# EAGLE design Arduino_MEGA_2560-Rev5- Shield (EAGLE 7.5.0)
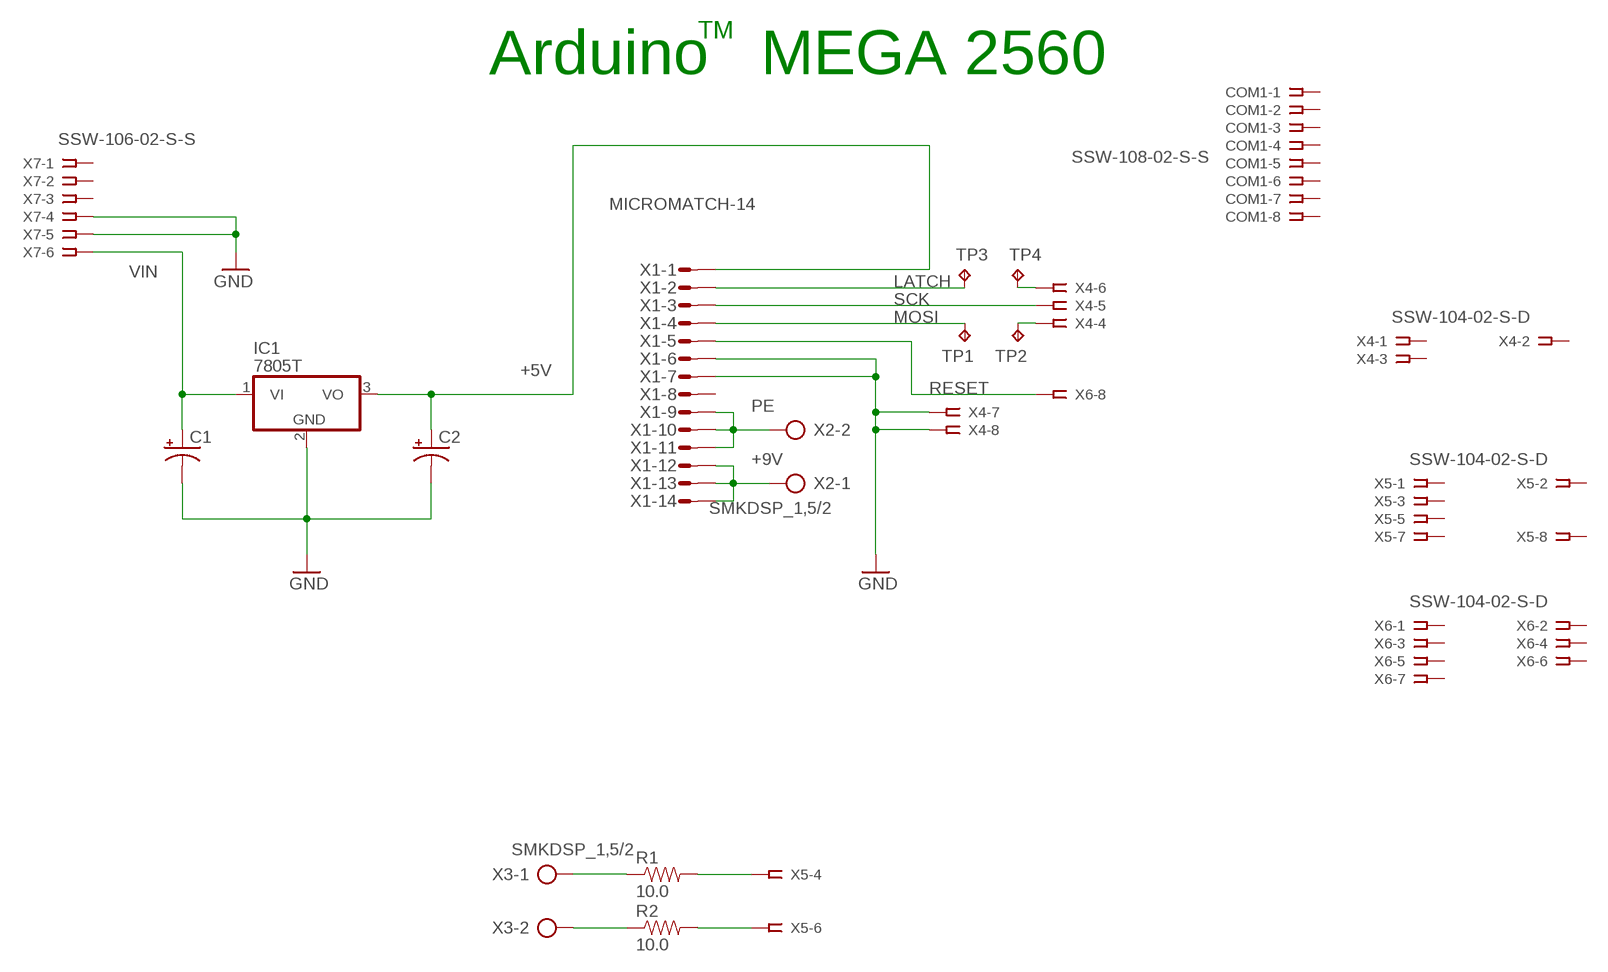
[diagram p0: schematic, sheet 1]

## Parts
C1  CAP_POL7343  [EIA7343]
C2  CAP_POL7343  [EIA7343]
COM1  SSW-108-02-S-S  [SSW-108-02-S-S]
IC1  7805T  [TO220H]
R1  10.0  10OHM-1/4W-1%(PTH)VERT  [AXIAL-0.1]
R2  10.0  10OHM-1/4W-1%(PTH)VERT  [AXIAL-0.1]
TP1  TPPAD1-13  [P1-13]
TP2  TPPAD1-13  [P1-13]
TP3  TPPAD1-13  [P1-13]
TP4  TPPAD1-13  [P1-13]
X1  MICROMATCH-14  [MICROMATCH-14]
X2  SMKDSP_1,5/2  [SMKDSP_1,5/2]
X3  SMKDSP_1,5/2  [SMKDSP_1,5/2]
X4  SSW-104-02-S-D  [SSW-104-02-S-D]
X5  SSW-104-02-S-D  [SSW-104-02-S-D]
X6  SSW-104-02-S-D  [SSW-104-02-S-D]
X7  SSW-106-02-S-S  [SSW-106-02-S-S]

## Nets
+5V [power usb]: C2.A(+) IC1.3(VO) X1.1
+9V: X1.12 X1.13 X1.14 X2.1
GND [gnd]: C1.C(-) C2.C(-) IC1.2(GND) X1.6 X1.7 X4.7 X4.8 X7.4 X7.5
LATCH: TP3.TP X1.2
MOSI: TP1.TP X1.4
N$1: R1.P$1 X3.1
N$2: R1.P$2 X5.4
N$3: R2.P$1 X3.2
N$4: R2.P$2 X5.6
N$5: TP2.TP X4.4
N$7: TP4.TP X4.6
PE: X1.9 X1.10 X1.11 X2.2
RESET: X1.5 X6.8
SCK: X1.3 X4.5
VIN [power]: C1.A(+) IC1.1(VI) X7.6
Unconnected: COM1.1 COM1.2 COM1.3 COM1.4 COM1.5 COM1.6 COM1.7 COM1.8 X1.8 X4.1 X4.2 X4.3 X5.1 X5.2 X5.3 X5.5 X5.7 X5.8 X6.1 X6.2 X6.3 X6.4 X6.5 X6.6 X6.7 X7.1 X7.2 X7.3

## Notes on the sheet
- TM
- Arduino   MEGA 2560

## Library data of the parts
C1 C2 = SparkFun-Capacitors:CAP_POL: Capacitor Polarized These are standard SMD and PTH capacitors. Normally 10uF, 47uF, and 100uF in electrolytic and tantalum varieties. Always verify the external diameter of the through hole cap, it varies with capacity, voltage, and manufacturer. The EIA devices should be standard.; PROD_ID: CAP-08702
COM1 = con-samtec:SSW-108-02-S-S: THROUGH-HOLE .025" SQ POST SOCKET Source: Samtec SSW.pdf; MPN: SSW-108-02-S-S; OC_FARNELL: unknown; OC_NEWARK: 11P9448
IC1 = linear:78*: Positive VOLTAGE REGULATOR Source: http://cache.national.com/ds/LM/LM78L05.pdf http://www.fairchildsemi.com/ds/LM/LM7805.pdf
R1 R2 = SparkFun-Resistors:10OHM-1/4W-1%(PTH): RES-12180; PROD_ID: RES-12180
TP1-TP4 = testpad:TP: Test pad
X1 = con-amp-micromatch:MICROMATCH-14: MicroMaTch 14 8-215464-4 / 1-215464-4 Drawing Number C-215464 DDEController.pdf; MF: FARNELL; MPN: 8-215464-4; OC_FARNELL: 3784678; OC_NEWARK: 19J6431
X2 X3 = con-phoenix-smkdsp:SMKDSP_1,5/2: Printklemme, Nennstrom: 17,5 A, Bemessungsspannung: 250 V, Raster: 5,0 mm Source: http://eshop.phoenixcontact.de .. 1733415.pdf; MF: FARNELL; MPN: 1733570; OC_FARNELL: 3041244; OC_NEWARK: 69C8588
X4-X6 = con-samtec:SSW-104-02-S-D: THROUGH-HOLE .025" SQ POST SOCKET Source: Samtec SSW.pdf; MPN: SSW-104-02-S-D; OC_FARNELL: 1668346; OC_NEWARK: 11P9382
X7 = con-samtec:SSW-106-02-S-S: THROUGH-HOLE .025" SQ POST SOCKET Source: Samtec SSW.pdf; MPN: SSW-106-02-S-S; OC_FARNELL: unknown; OC_NEWARK: 11P9416

## Net classes
0 default: width 0.203 mm, drill 0.406 mm, clearance 0.203 mm
1 power: width 0.61 mm, drill 0.406 mm, clearance 0.203 mm
2 gnd: width 0.305 mm, drill 0.406 mm, clearance 0.203 mm
3 power usb: width 0.508 mm, drill 0.406 mm, clearance 0.203 mm

## Board
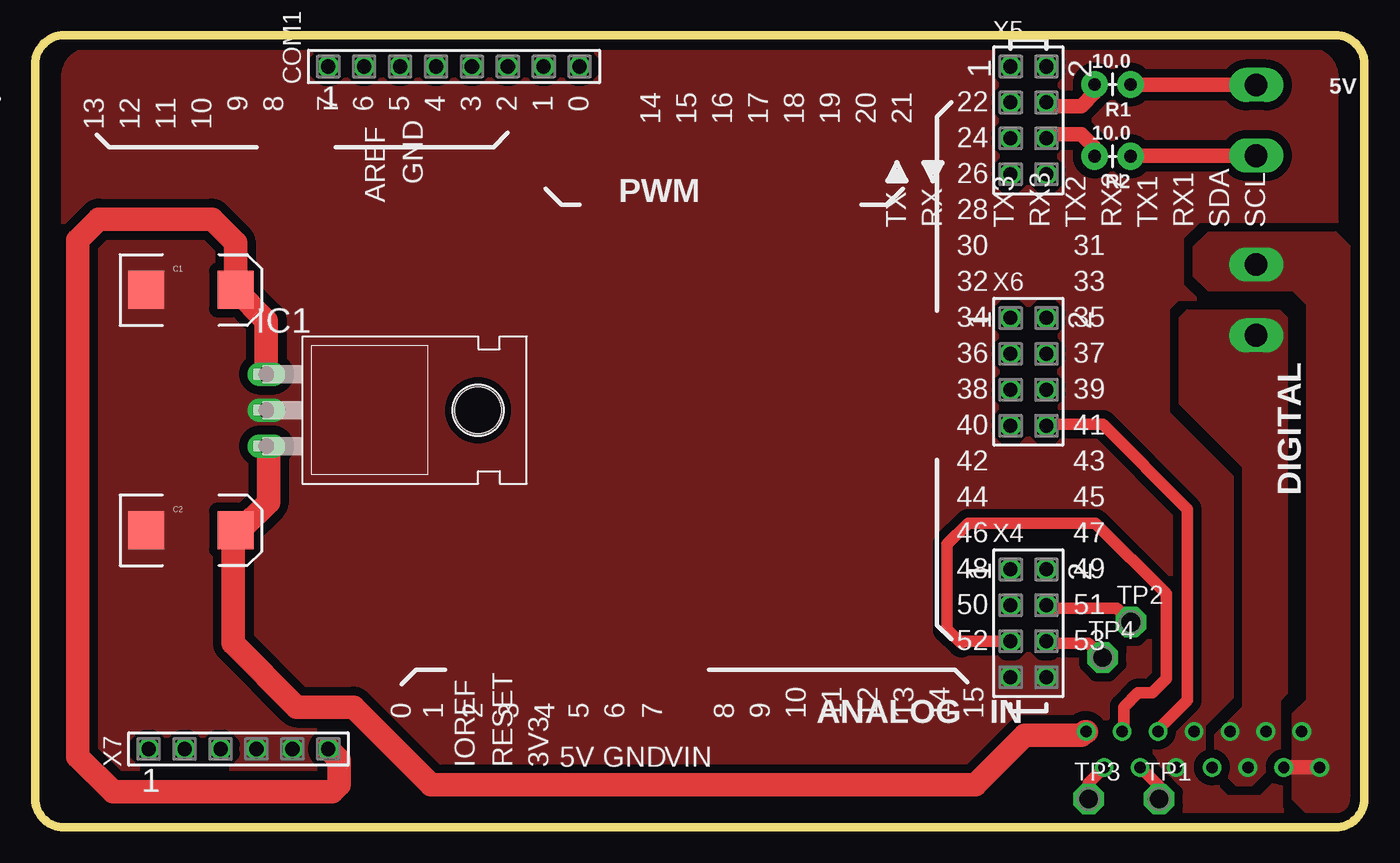
[diagram p1: board, top side]
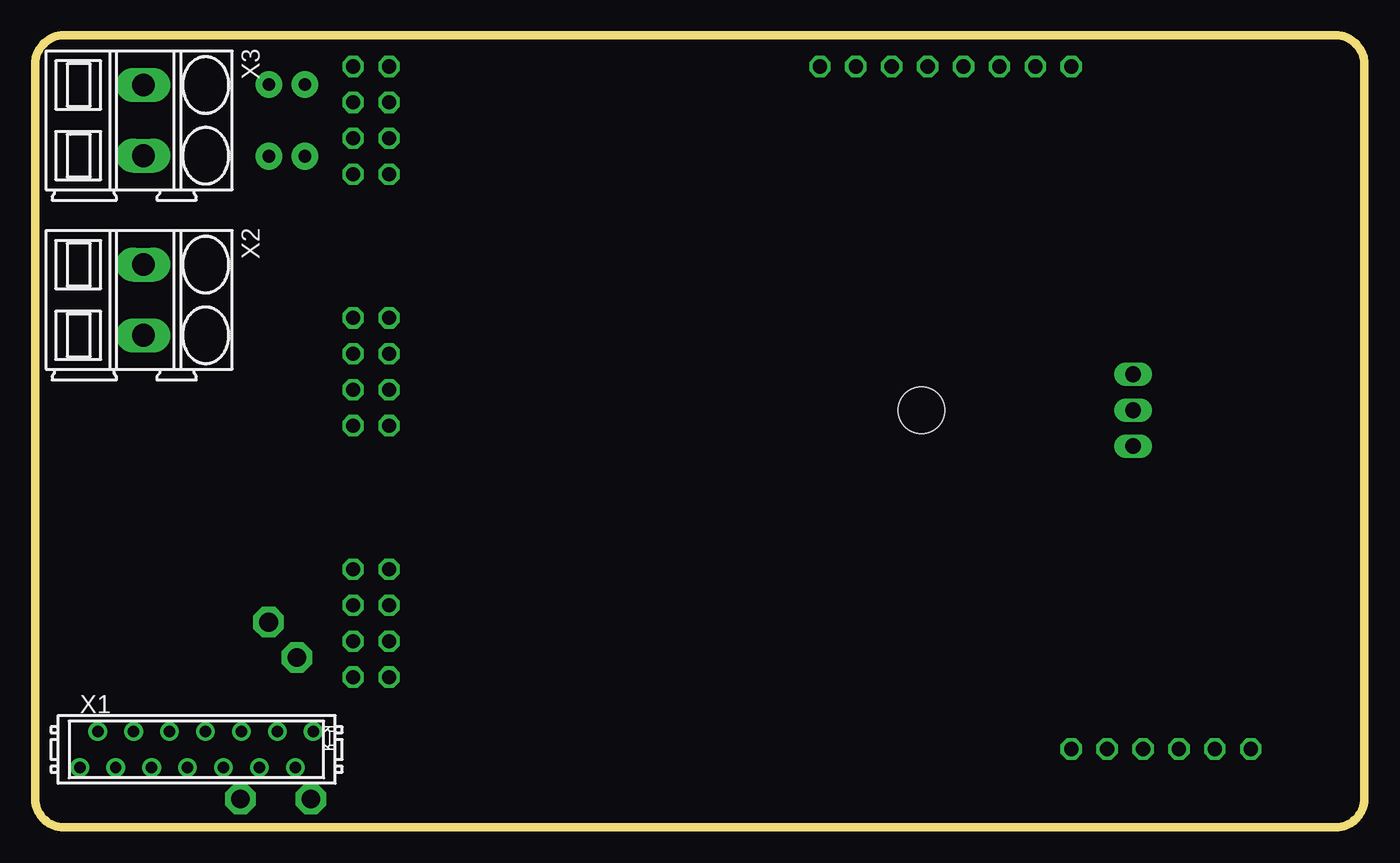
[diagram p2: board, bottom side, seen from below]

Size 94 x 56 mm. Coordinates in mm from the lower left corner, seen from the top.
Outline: 94,54 94,2 arc-90 92,0 2,0 arc-90 0,2 0,54 arc-90 2,56 92,56 arc-90 94,54
Copper layers (1*16): Top 0.035mm / dielectric 1.5mm / Bottom 0.035mm
Design rules "default *": minimum track width 8mil, minimum drill 16mil, track to track 18mil, track to pad 18mil, pad to pad 18mil, via to via 18mil, smd to smd 18mil, copper to edge 27mil, drill to drill 20mil, minimum pad ring 10mil, minimum via ring 10mil, stop-mask expansion 2mil, vias tented up to drill 24mil, thermal gap 10mil

### Footprints (pad centres in the part's own frame; a part is rotated, then mirrored left to right if it is on the bottom)
EIA7343 = smd 2.55 x 2.7: A 3.17,0; C -3.17,0
SSW-108-02-S-S = drill 1 pad 1.5 octagon: 1 -8.89,0; 2 -6.35,0; 3 -3.81,0; 4 -1.27,0; 5 1.27,0; 6 3.81,0; 7 6.35,0; 8 8.89,0
TO220H = drill 1.118 long: 1 -2.54,-10.16; 2 0,-10.16; 3 2.54,-10.16 | hole 3.302: 0,4.826
AXIAL-0.1 = drill 0.9 pad 1.88: P$1 0,0; P$2 2.54,0
P1-13 = drill 1.321 pad 2.159 octagon: TP 0,0
MICROMATCH-14 = drill 0.813: 1 8.255,1.27; 2 6.985,-1.27; 3 5.715,1.27; 4 4.445,-1.27; 5 3.175,1.27; 6 1.905,-1.27; 7 0.635,1.27; 8 -0.635,-1.27; 9 -1.905,1.27; 10 -3.175,-1.27; 11 -4.445,1.27; 12 -5.715,-1.27; 13 -6.985,1.27; 14 -8.255,-1.27
SMKDSP_1,5/2 = drill 1.6 pad 1.8 long: 1 -2.5,0; 2 2.5,0
SSW-104-02-S-D = drill 1 pad 1.5 octagon: 1 -3.81,-1.27; 2 -3.81,1.27; 3 -1.27,-1.27; 4 -1.27,1.27; 5 1.27,-1.27; 6 1.27,1.27; 7 3.81,-1.27; 8 3.81,1.27
SSW-106-02-S-S = drill 1 pad 1.5 octagon: 1 -6.35,0; 2 -3.81,0; 3 -1.27,0; 4 1.27,0; 5 3.81,0; 6 6.35,0

### Placement (x,y rotation side)
C1  11,38 0 top
C2  11,21 0 top
COM1  29.61,53.8 0 top
IC1  26.5,29.5 270 top
R1  77.47,52.53 180 top
R2  77.47,47.45 180 top
TP1  79.5,2 0 top
TP2  77.5,14.5 0 top
TP3  74.5,2 0 top
TP4  75.5,12 0 top
X1  82.6,5.5 0 bottom
X2  86.36,37.29 270 bottom
X3  86.36,49.99 270 bottom
X4  70.25,14.43 270 top
X5  70.25,49.99 270 top
X6  70.25,32.21 270 top
X7  14.37,5.54 0 top

### Tracks (layer width: path | path; a pad name or v marks a point on that pad's centre or on a via)
+5V
  Top 1.676: IC1.3 16.5,26.8 16.5,23 14.5,21 | 14.5,21 C2.A | 14.5,21 14,20.5 14,13 18.5,8.5 22.5,8.5 28,3 66.5,3 70,6.5 74,6.5 74.27,6.77 X1.1
+9V
  Top 1.016: X1.12 X1.14
  pour Top (isolate 0.61, rank 3, no thermals): 83,38 82,39 82,41 83,42 92,42 94,40 94,2 93,1 90,1 89,2 89,8 90,9 90,37 89,38
GND
  pour Top (isolate 0.61, rank 4, no thermals): 92,1 92,53 arc90 90,55 4,55 arc90 2,53 2,1
LATCH
  Top 0.813: X1.2 74.5,3.12 TP3.TP
MOSI
  Top 0.813: X1.4 79.5,2.88 TP1.TP
N$1
  Top 1.016: R1.P$1 77.51,52.49 X3.1
N$2
  Top 1.016: X5.4 71.78,51 74,51 74.93,51.93 R1.P$2
N$3
  Top 1.016: R2.P$1 77.51,47.49 X3.2
N$4
  Top 1.016: X5.6 71.8,49 74,49 74.93,48.07 R2.P$2
N$5
  Top 0.813: X4.4 71.72,15.5 76.5,15.5 TP2.TP
N$7
  Top 0.813: X4.6 71.68,13 74.5,13 TP4.TP
PE
  pour Top (isolate 0.61, rank 2, no thermals): 81,36 81,30 85.5,25.5 85.5,8.5 83.5,6.5 83.5,4.5 85,3 86,3 88,5 88,9 88.5,9.5 88.5,36 88,36.5 81.5,36.5
RESET
  Top 0.813: X6.8 71.5,28.42 71.5,28.5 75.5,28.5 81.5,22.5 81.5,9 79.42,6.92 X1.5
SCK
  Top 0.813: X1.3 77,6.88 77,8.5 78,9.5 79,9.5 80,10.5 80,16.5 75,21.5 66,21.5 64.5,20 64.5,14 65.5,13 65.66,13.16 X4.5
VIN
  Top 1.676: X7.6 21.5,4.76 21.5,3 21,2.5 5.5,2.5 3,5 3,41.5 4.5,43 12.5,43 14.17,41.33 C1.A 16.34,35.83 IC1.1

### Text on the board
tPlace: 9 | 8 | 7 | 6 | 5 | 4 | 3 | 2 | 1 | 0 | 22 | 14 | 15 | 16 | 17 | 18 | 19 | 20 | 21 | 13 | 12 | 11 | 10 | 24 | 26 | 28 | 30 | 31 | 32 | 33 | 34 | 35 | 36 | 37 | 38 | 39 | 40 | 41 | 42 | 43 | 44 | 45 | 46 | 47 | 48 | 49 | 50 | 51 | 52 | 53 | 0 | 1 | 2 | 3 | 4 | 5 | 6 | 7 | 8 | 9 | 10 | 11 | 12 | 13 | 14 | 15
tNames: 5V | GND | AREF | PWM | TX | RX | TX3 | RX3 | TX2 | RX2 | TX1 | RX1 | SDA | SCL | DIGITAL | ANALOG IN | GND | IOREF | RESET | 3V3 | 5V | GND | VIN